# Altium schematic sheet GCM_CH_SCH.SchDoc
size A; SheetNumber: 1; SheetTotal: 1
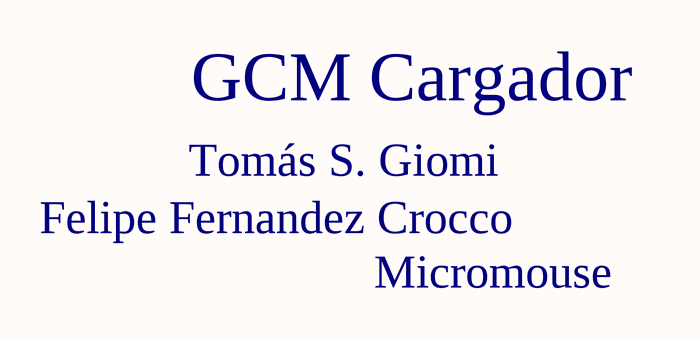
[diagram p0: GCM_CH_SCH.SchDoc]

## Notes on the sheet
- GCM Cargador
- Felipe Fernandez Crocco
- Tomás S. Giomi
- Micromouse